# Altium schematic sheet main.SchDoc: Combined Coil Driver
size A3; Author: dvarx; Engineer: dvarx; Organization: MSRL
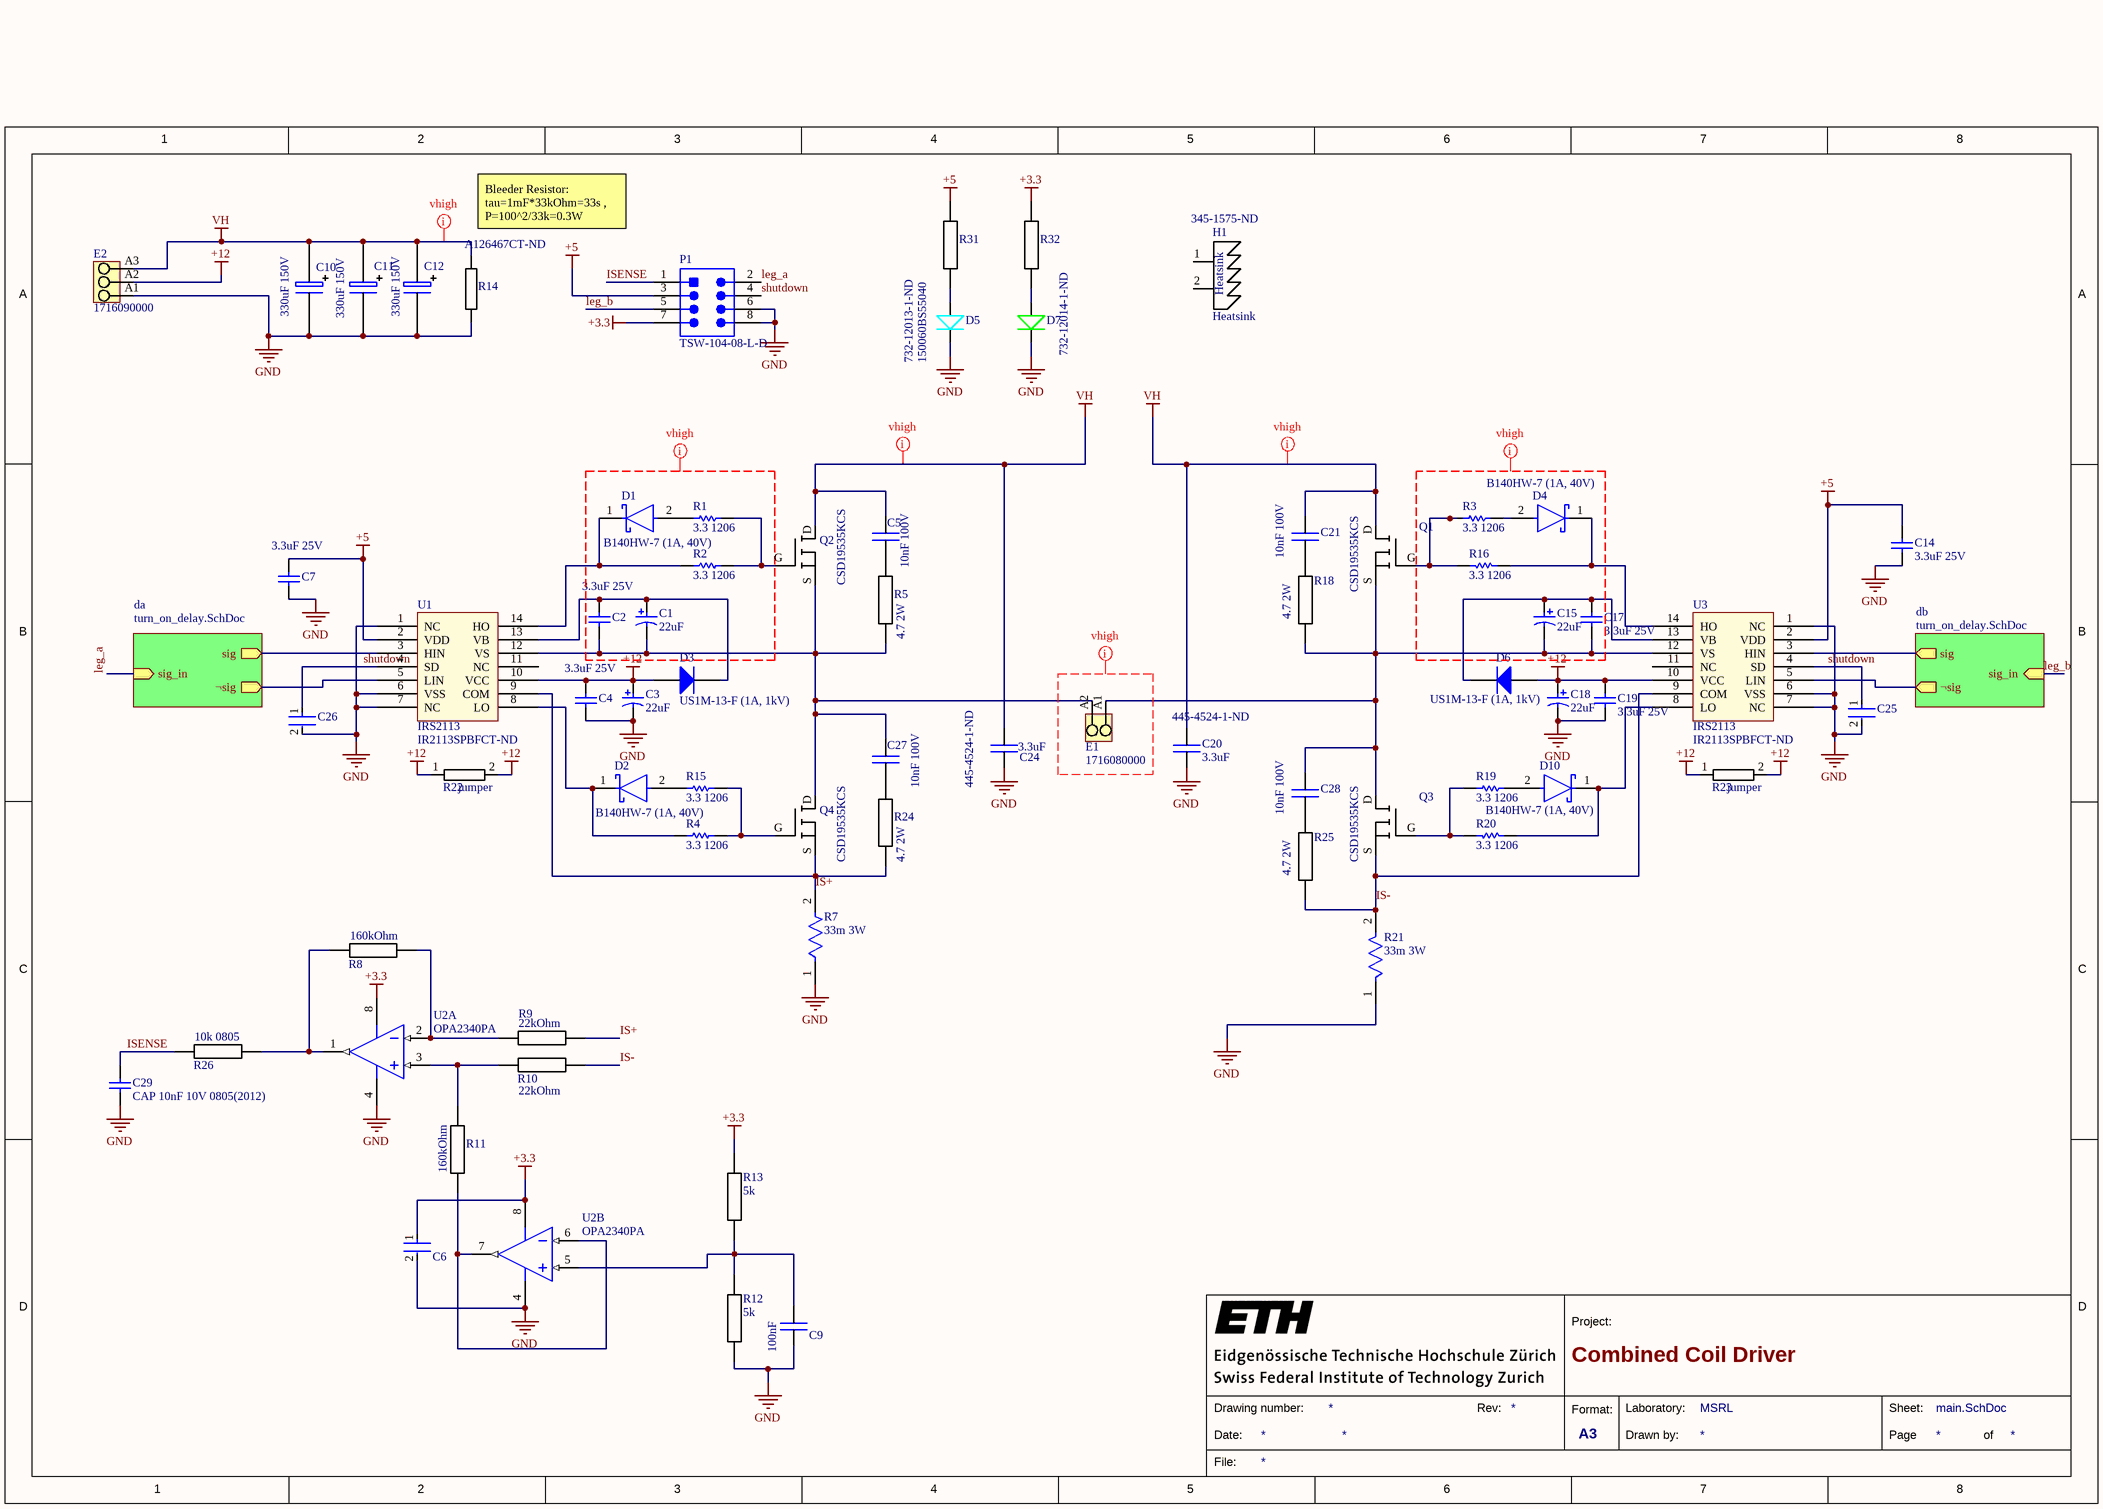
[diagram p0: main.SchDoc]

## Parts
C1  22uF  [KEMT-D-7343-31-2_L]
C2  3.3uF 25V  [CAPC1210(3225)170_M]
C3  22uF  [KEMT-D-7343-31-2_L]
C4  3.3uF 25V  [CAPC1210(3225)170_M]
C5  10nF 100V  [1206]
C6  C0603X104K5RACTU  [FP-C0603-CJ-MFG]  (value not drawn)
C7  3.3uF 25V  [CAPC1210(3225)170_M]
C9  100nF  [0805]
C10  330uF 150V  [cap_electrolyte]
C11  330uF 150V  [cap_electrolyte]
C12  330uF 150V  [cap_electrolyte]
C14  3.3uF 25V  [CAPC1210(3225)170_M]
C15  22uF  [KEMT-D-7343-31-2_L]
C17  3.3uF 25V  [CAPC1210(3225)170_M]
C18  22uF  [KEMT-D-7343-31-2_L]
C19  3.3uF 25V  [CAPC1210(3225)170_M]
C20  3.3uF  Supplier Part Number 1: 445-4524-1-ND  [SMD_5750]
C21  10nF 100V  [1206]
C24  3.3uF  Supplier Part Number 1: 445-4524-1-ND  [SMD_5750]
C25  CC0603KRX7R9BB103  [FP-CC0603-DA-MFG]  (value not drawn)
C26  CC0603KRX7R9BB103  [FP-CC0603-DA-MFG]  (value not drawn)
C27  10nF 100V  [1206]
C28  10nF 100V  [1206]
C29  CAP 10nF 10V 0805(2012)  [CAPC0805(2012)100_N]
D1  B140HW-7 (1A, 40V)  [FP-SOD123-MFG]
D2  B140HW-7 (1A, 40V)  [FP-SOD123-MFG]
D3  US1M-13-F (1A, 1kV)  [DIOD-SMA-2_A_V]
D4  B140HW-7 (1A, 40V)  [FP-SOD123-MFG]
D5  150060BS55040  Supplier Part Number 1: 732-12013-1-ND  [LED_BLUE_0603]
D6  US1M-13-F (1A, 1kV)  [DIOD-SMA-2_A_V]
D7  732-12014-1-ND  [LED_GREEN_0603]
D10  B140HW-7 (1A, 40V)  [FP-SOD123-MFG]
E1  1716080000  [LM_5_08_90_02]
E2  1716090000  [LM_5_08_90_03]
H1  Heatsink  Supplier Part Number 1: 345-1575-ND  [omni-uni-30-75-d]
P1  TSW-104-08-L-D  [SMTC-TSW-104-08-L-D_V]
Q1  CSD19535KCS  [TO-220]
Q2  CSD19535KCS  [TO-220]
Q3  CSD19535KCS  [TO-220]
Q4  CSD19535KCS  [TO-220]
R1  3.3 1206  [RESC3216X70X50LL05T20]
R2  3.3 1206  [RESC3216X70X50LL05T20]
R3  3.3 1206  [RESC3216X70X50LL05T20]
R4  3.3 1206  [RESC3216X70X50LL05T20]
R5  4.7 2W  [2512]
R7  33m 3W  [FP-KRL6432E-M-R033-F-T1-MFG]
R8  160kOhm  [0805]
R9  22kOhm  [0805]
R10  22kOhm  [0805]
R11  160kOhm  [0805]
R12  5k  [0805]
R13  5k  [0805]
R14  Supplier Part Number 1: A126467CT-ND  [res_bleeder]  (hidden comment: CRGH2512J33K)
R15  3.3 1206  [RESC3216X70X50LL05T20]
R16  3.3 1206  [RESC3216X70X50LL05T20]
R18  4.7 2W  [2512]
R19  3.3 1206  [RESC3216X70X50LL05T20]
R20  3.3 1206  [RESC3216X70X50LL05T20]
R21  33m 3W  [FP-KRL6432E-M-R033-F-T1-MFG]
R22  jumper  [tht_resistor_10mm]
R23  jumper  [tht_resistor_10mm]
R24  4.7 2W  [2512]
R25  4.7 2W  [2512]
R26  10k 0805  [0805]
R31  res_smd  [0805]  (value not drawn)
R32  res_smd  [0805]  (value not drawn)
U1  IRS2113  Supplier Part Number 1: IR2113SPBFCT-ND  [DIP14]
U2  OPA2340PA  [P0008A]  (parts A,B of 2)
U3  IRS2113  Supplier Part Number 1: IR2113SPBFCT-ND  [DIP14]

## Sub-sheets
da = turn_on_delay.SchDoc: sig_in (in), sig (out), ¬sig (out)
db = turn_on_delay.SchDoc: sig_in (in), sig (out), ¬sig (out)

## Nets
+3.3: C6.1 P1.7 R13.2 R32.1 U2.8(V+)
+5: C7.2 C14.2 P1.3 R31.1 U1.2(VDD) U3.2(VDD)
+12: C3.1 C4.2 C18.1 C19.2 D3.1(A) D6.1(A) E2.A2 R22.1 R22.2 R23.1 R23.2 U1.10(VCC) U3.10(VCC)
GND: C3.2 C4.1 C6.2 C7.1 C9.2 C10.2 C11.2 C12.2 C14.1 C18.2 C19.1 C20.2 C24.2 C25.2 C26.2 C29.1 D5.K D7.K E2.A1 P1.6 P1.8 R7.1 R12.1 R14.1 R21.1 U1.1(NC) U1.6(VSS) U1.7(NC) U2.4(V-) U3.1(NC) U3.6(VSS) U3.7(NC)
VH: C5.1 C10.1 C11.1 C12.1 C20.1 C21.1 C24.1 E2.A3 Q1.D Q2.D R14.2
IS+: Q4.S R7.2 R9.2 R24.2 U1.9(COM)
IS-: Q3.S R10.2 R21.2 R25.2 U3.9(COM)
ISENSE: C29.2 P1.1 R26.1
leg_a: P1.2 ; sheet da/sig_in
leg_b: P1.5 ; sheet db/sig_in
shutdown: C25.1 C26.1 P1.4 U1.4(SD) U3.4(SD)
NetC1_1: C1.1 C2.2 D3.2(K) U1.13(VB)
NetC1_2: C1.2 C2.1 C27.1 E1.A2 Q2.S Q4.D R5.2 U1.12(VS)
NetC5_2: C5.2 R5.1
NetC9_1: C9.1 R12.2 R13.1 U2.5(IN_B+)
NetC15_1: C15.1 C17.2 D6.2(K) U3.13(VB)
NetC15_2: C15.2 C17.1 C28.1 E1.A1 Q1.S Q3.D R18.2 U3.12(VS)
NetC21_2: C21.2 R18.1
NetC27_2: C27.2 R24.1
NetC28_2: C28.2 R25.1
NetD1_1: D1.1(C) R2.1 U1.14(HO)
NetD1_2: D1.2(A) R1.1
NetD2_1: D2.1(C) R4.1 U1.8(LO)
NetD2_2: D2.2(A) R15.1
NetD4_1: D4.1(C) R16.1 U3.14(HO)
NetD4_2: D4.2(A) R3.2
NetD5_A: D5.A R31.2
NetD7_A: D7.A R32.2
NetD10_1: D10.1(C) R20.1 U3.8(LO)
NetD10_2: D10.2(A) R19.2
NetQ1_G: Q1.G R3.1 R16.2
NetQ2_G: Q2.G R1.2 R2.2
NetQ3_G: Q3.G R19.1 R20.2
NetQ4_G: Q4.G R4.2 R15.2
NetR8_1: R8.1 R26.2 U2.1(OUT_A)
NetR8_2: R8.2 R9.1 U2.2(IN_A-)
NetR10_1: R10.1 R11.2 U2.3(IN_A+)
NetR11_1: R11.1 U2.6(IN_B-) U2.7(OUT_B)
NetU1_3: U1.3(HIN) ; sheet da/sig
NetU1_5: U1.5(LIN) ; sheet da/¬sig
NetU3_3: U3.3(HIN) ; sheet db/sig
NetU3_5: U3.5(LIN) ; sheet db/¬sig

Not connected (* = marked no-connect by the designer): H1 1(0) 2(1); U1 11(NC); U3 11(NC)

## Layout directives
net class vhigh: (no net found under the mark), VH

## Notes on the sheet
- (near R14) Bleeder Resistor: tau=1mF*33kOhm=33s , P=100^2/33k=0.3W
- 1
- 2
- 3
- 4
- 5
- 6
- 7
- 8
- A
- B
- C
- D
- Project:
- Date:
- Drawing number:
- Rev:
- Format:
- A3
- Drawn by:
- Laboratory:
- Page
- Sheet:
- of
- File:

## Library data of the parts
C1 C3 C15 C18 = CMP-2000-07210-1: Capacitor, Tantalum, 22 uF, +/- 10%, 35 V, -55 to 125 degC, 2-Pin Molded, RoHS, Tape and Reel; Manufacturer: Kemet; Seal: NotRequired; Voltage: 35VDC; Product Diameter (mm): NotRequiredmm; DCL: 7.7uA; ESR: 0.3ohm; Product Depth (mm): 4.3mm; Polarity: Polar; Capacitance: 22000000pF; DF: 6%; Product Height (mm): 2.8mm; Product Length (mm): 7.3mm; Rad Hardened: No; Mounting Technology: SurfaceMount; Packaging: TapeandReel; Case Code: D; Datasheet URL: https://datasheet.ciiva.com/28561/1780647-28561674.pdf; Case Style: Molded; Datasheet Version: 12/2013; Length W/Weld: NotRequiredmm; Insulation: NotRequired; Construction: SMTChip; Operating Temp Range: -55Cto125C; Lead Spacing (nom): NotRequiredmm; Package Description: 2-Pin Surface Mount Device, Body 7.3 x 4.3 mm, Height 3.1 mm; Package Reference: Molded-2; Wire Form: NotRequired; Length W/Weld (max): NotRequiredmm; Manufacturer URL: http://www.kemet.com/; Mounting Style: SurfaceMount; Tolerance (+ or -): 10%; Seated Plane Height: NotRequiredmm; Failure Rate: NotRequired; Package / Case: 7343-31
C2 C4 C7 C14 C17 C19 = CMP-1038-02118-1: CAP 3.3uF 25V ±10% 1210 (3225 Metric) Thickness 1.7mm SMD; Tolerance: Â±10%; Case-EIA: 1210; Case-Metric: 3225; Max Thickness: 1.7 mm; Technology: SMT; Value: 3.3uF; Rated Voltage: 25 V
C5 C9 C20 C21 C24 C27 C28 = cap_smd
  C5 C21 C27 C28: Supplier 1: Digi-Key; Supplier Part Number 1: 445-2334-1-ND; Supplier 2: Digi-Key; Supplier Part Number 2: 445-15417-1-ND; Supplier 3: Digi-Key; Supplier Part Number 3: 478-1512-1-ND
  C20 C24: Supplier 1: Digi-Key
C6 = CMP-2006-03300-2: CAP CER 0.1UF 50V X7R 0603; Manufacturer: Kemet; Capacitance: 100nF; Material: Ceramic; Tolerance: 10%; Value: 100nF; Temperature Coefficient: 15%; Temperature Range High: +125°C; Temperature Range Low: -55°C; Manufacturer Part Number: C0603X104K5RACTU; Voltage: 50V; ComponentLink2Description: Datasheet; RoHS: TRUE; ComponentLink2URL: https://content.kemet.com/datasheets/KEM_C1013_X7R_FT-CAP_SMD.pdf; Device Class L3: Ceramic Capacitors; Device Class L2: Capacitors; Package: C0603-CJ; Height: 0.95mm; Device Class L1: Passive Components; Temperature Characteristic: X7R; Lead Free: Yes; Digikey Description: CAP CER 0.1UF 50V X7R 0603; Automotive: No; Mouser Description: Capacitor; Ceramic; Cap 0.1uF; Tol+10%; SMT; Flexible Termination; Vol-Rtg 50V; TR; Temperature: -55°C to +125°C; Octopart: https://octopart.com/c0603x104k5ractu-kemet-9145062; Category: Cap; Voltage Rating: 50V; Ipc Land Pattern Name: CAPC16080X80
C10-C12 = cap_electrolyte: partno: UCS2C151MHD1TN; ComponentLink1Description: Supplier Link; ComponentLink1URL: https://www.digikey.ch/product-detail/en/nichicon/UCS2C151MHD1TN/493-7378-1-ND/3768656
C25 C26 = CMP-2100-03600-2: CAP CER 10000PF 50V X7R 0603; Manufacturer: YAGEO; Tolerance: 0.1; Material: Ceramic; Temperature Coefficient: 15%; Value: 10 nF; Mouser Description: Multilayer Ceramic Capacitor, CC Series, 0.01 - F, - 10%, X7R, 50 V, 0603 [1608 Metric]; Digikey Description: CAP CER 10000PF 50V X7R 0603; Height: 0.9mm; Category: Cap; Temperature Characteristic: X7R; Footprint Url: http://www.yageo.com/exep/pages/download/literatures/UPY-C_GEN_24.pdf; Lead Free: Yes; Voltage Rating: 50 V; Manufacturer Part Number: CC0603KRX7R9BB103; Temperature: -55°C to +125°C; Device Class L3: Ceramic Capacitors; ComponentLink2Description: Datasheet; Voltage: 50 V; Package: CC0603-DA; Octopart: https://octopart.com/cc0603krx7r9bb103-yageo-192938; Automotive: No; Temperature Range High: +125°C; Temperature Range Low: -55°C; RoHS: TRUE; Device Class L1: Passive Components; ComponentLink2URL: http://www.yageo.com/documents/recent/UPY-GPHC_X7R_6.3V-to-50V_18.pdf; Device Class L2: Capacitors; Capacitance: 10 nF
C29 = CMP-1036-03807-1: CAP 10nF 10V ±5% 0805 (2012 Metric) Thickness 1mm SMD; Case-Metric: 2012; Case-EIA: 0805; Tolerance: Â±5%; Rated Voltage: 10 V; Technology: SMT; Value: 10nF; Max Thickness: 1 mm
D1 = CMP-12790-000013-1: DIODE SCHOTTKY 40V 1A SOD123 Alternative: 1655-2275-1-ND - Cut Tape (CT)Alternative: MBRX120LF-TPMSCT-ND (20V)1655-1439-1-ND (60V); Manufacturer: Diodes Inc.; Peak Reverse Current: 40uA; Value: 120pF; Standoff Height: 0mm; Max Junction Temp: +125°C; Max Surge Forward Current: 16A; RoHS: TRUE; Ipc Land Pattern Name: SOD365155X110-2; Reverse Voltage: 40V; Temperature Range Low: -65°C; Capacitance: 120pF; Temperature Range High: +125°C; Mouser Description: Schottky Diodes & Rectifiers SCHOTTKY RECTIFIER SOD-123 1.0A 40V; ComponentLink2URL: https://www.diodes.com/assets/Datasheets/ds30670.pdf; Automotive: No; Package: SOD123; Octopart: https://octopart.com/b140hw-7-diodes+inc.-325751; Footprint Url: https://www.diodes.com/assets/Package-Files/SOD123.pdf; Max Repetitive Reverse Voltage: 40V; Category: Diode; Device Class L3: Schottky Diodes; Manufacturer Part Number: B140HW-7; Digikey Description: DIODE SCHOTTKY 40V 1A SOD123; Lead Free: Yes; Device Class L1: Discrete Semiconductors; ComponentLink2Description: Datasheet; Forward Current: 1A; Device Class L2: Diodes; Temperature: -65°C to +125°C; Height: 1.45mm
D2 D4 D10 = CMP-12790-000013-1: DIODE SCHOTTKY 40V 1A SOD123 Alternative: 1655-2275-1-ND - Cut Tape (CT); Manufacturer: Diodes Inc.; Peak Reverse Current: 40uA; Value: 120pF; Standoff Height: 0mm; Max Junction Temp: +125°C; Max Surge Forward Current: 16A; RoHS: TRUE; Ipc Land Pattern Name: SOD365155X110-2; Reverse Voltage: 40V; Temperature Range Low: -65°C; Capacitance: 120pF; Temperature Range High: +125°C; Mouser Description: Schottky Diodes & Rectifiers SCHOTTKY RECTIFIER SOD-123 1.0A 40V; ComponentLink2URL: https://www.diodes.com/assets/Datasheets/ds30670.pdf; Automotive: No; Package: SOD123; Octopart: https://octopart.com/b140hw-7-diodes+inc.-325751; Footprint Url: https://www.diodes.com/assets/Package-Files/SOD123.pdf; Max Repetitive Reverse Voltage: 40V; Category: Diode; Device Class L3: Schottky Diodes; Manufacturer Part Number: B140HW-7; Digikey Description: DIODE SCHOTTKY 40V 1A SOD123; Lead Free: Yes; Device Class L1: Discrete Semiconductors; ComponentLink2Description: Datasheet; Forward Current: 1A; Device Class L2: Diodes; Temperature: -65°C to +125°C; Height: 1.45mm
  D4: Parameter 1: *
D3 D6 = CMP-2000-07364-1: Ultra-Fast Rectifier, 1 A, 1.7 V, -65 to 150 degC, 2-Pin SMA, RoHS, Tape and Reel; Manufacturer: Diodes Inc; Forward Voltage: 1.7V; Reverse Recovery Time-Max: 75ns; Reverse Current-Max: 5µA; Reverse Voltage-Max [Vrrm]: 1000V; Package Description: 2-Pin Surface Mount Device, Body 4.3 x 2.605 mm; Datasheet URL: http://www.diodes.com/_files/datasheets/ds16008.pdf; Average Rectified Current-Max: 1A; Datasheet Version: Rev. 11-2, 12/2014; Package Reference: SMA-2; Mounting Technology: SurfaceMount; Manufacturer URL: http://www.diodes.com/
D5 = led_blue_0603: Supplier 1: Digi-Key
D7 = led_green_0603: Supplier 1: Digi-Key; Supplier Part Number 1: 732-12014-1-ND
E1 = CMP-1559-01766-1: OMNIMATE Signal - series LM; Manufacturer: Weidmueller; Solder_pin_length_mm: 3,5 mm; Solid_max_H05_07_V_U: 2,5 mm²; Contact_material: Cu-Leg; No_of_poles: 2; Mounting_onto_the_PCB: Solder connection; Contact_surface: tinned; Wire_cross_section_AWG_max_UL_1059: AWG 14; Rated_voltage_for_surge_voltage_class_pollution_degree_II_2: 630 V; Side_termination_characteristic: closed side; UL_94_flammability_rating: V-0; Wire_cross_section_AWG_min_UL_1059: AWG 24; Pitch_mm: 5,08 mm; Pitch_inch: 0,2 inch; Rated_voltage_use_group_B_UL_1059: 300 V; Solid_min_H05_07_V_U: 0,2 mm²; Short_text_for_material: LM 5.08/02/90 3.5SN OR BX; Insulating_material: Wemid (PA); Rated_current_use_group_B_UL_1059: 15 A; PartNumber: 1716080000; Colour: Orange; ComponentLink1URL: http://www.weidmueller.com/; ComponentLink1Description: Manufacturer URL; Revision: V1; Qty: 500 PCS; ComponentLink2Description: URL Link1; ComponentLink2URL: http://catalog.weidmueller.com/catalog/Start.do?localeId=en&ObjectID=1716080000; Packaging: Box; PackageReference: LM_5_08_90_02
E2 = CMP-1559-01768-1: OMNIMATE Signal - series LM; Manufacturer: Weidmueller; Contact_surface: tinned; Pitch_mm: 5,08 mm; Solder_pin_length_mm: 3,5 mm; Contact_material: Cu-Leg; Wire_cross_section_AWG_min_UL_1059: AWG 24; Solid_min_H05_07_V_U: 0,2 mm²; Insulating_material: Wemid (PA); Solid_max_H05_07_V_U: 2,5 mm²; Pitch_inch: 0,2 inch; Wire_cross_section_AWG_max_UL_1059: AWG 14; UL_94_flammability_rating: V-0; No_of_poles: 3; Rated_voltage_use_group_B_UL_1059: 300 V; Mounting_onto_the_PCB: Solder connection; Side_termination_characteristic: closed side; Short_text_for_material: LM 5.08/03/90 3.5SN OR BX; Rated_current_use_group_B_UL_1059: 15 A; Rated_voltage_for_surge_voltage_class_pollution_degree_II_2: 630 V; Revision: V1; ComponentLink2URL: http://catalog.weidmueller.com/catalog/Start.do?localeId=en&ObjectID=1716090000; Colour: Orange; PackageReference: LM_5_08_90_03; ComponentLink1Description: Manufacturer URL; ComponentLink2Description: URL Link1; ComponentLink1URL: http://www.weidmueller.com/; Qty: 500 PCS; PartNumber: 1716090000; Packaging: Box
P1 = CMP-1681-00006-4: Male Header, Pitch 2.54 mm, 2 x 4 Position, Height 8.38 mm, Tail Length 5.08 mm, -55 to 125 degC, RoHS, Bulk; Manufacturer: Samtec; Voltage Rating: 550 V; Current Rating: 7.6 A; Rows: 2; ComponentLink2URL: https://datasheet.ciiva.com/25616/0900766b81154476-25616879.pdf; Package Quantity: 1; PackageDescription: Male Header, Pitch 2.54 mm, 2 x 4 Position, Height 8.38 mm, Tail Length 5.08 mm; ComponentLink1Description: Manufacturer URL; Lead Pitch: 0.1 inch; REACH SVHC: No SVHC; Mounting Technology: Through Hole; PackageReference: TSW-104-08-L-D; Contact Plating: Gold; DatasheetVersion: 04/2012; Colour: Black; Contact Finish: Gold; ComponentLink3URL: http://suddendocs.samtec.com/prints/tsw-xxx-xx-x-x-xx-xxx-footprint.pdf; ComponentLink3Description: Package Specification; Mount: Through Hole; RoHSCompliant: true; Packaging: Bulk; ComponentLink2Description: Datasheet; Contact Material: Bronze; Pins: 8; ComponentLink1URL: http://www.samtec.com/
R1-R4 R15 R16 R19 R20 = CMP-2003-00687-1: Part Number: ERJ-8RQF3R3V; Manufacturer: Panasonic
R5 R8-R13 R18 R24-R26 = res_smd
  R5 R18 R24 R25: Supplier 1: Digi-Key; Supplier Part Number 1: CRM2512-JW-4R7ELFCT-ND; Supplier 2: Digi-Key; Supplier Part Number 2: CRM2512-JW-2R2ELFCT-ND; Supplier 3: Digi-Key; Supplier Part Number 3: CRM2512-JW-1R0ELFCT-ND; Supplier 4: Digi-Key; Supplier Part Number 4: CRM2512-JW-100ELFCT-ND
R7 R21 = CMP-28537-000006-1: RES 0.033 OHM 3W 2512 WIDE; Manufacturer Part Number: KRL6432E-M-R033-F-T1; Manufacturer: Susumu; Automotive Grade: Grade 0; Temperature Coefficient: 50ppm/°C; Value: 33mΩ; Tolerance: 1%; Temperature Range Low: -55°C; Octopart: https://octopart.com/krl6432e-m-r033-f-t1-susumu-24927468; Ipc Land Pattern Name: RESC310630X50; Power Rating: 3W; Device Class L3: Chip SMD Resistors; Mouser Description: Current Sense Resistors - SMD 3W 0.033ohm 1% 50ppm; Category: Res; Package: KRL6432E-M-R033-F-T1; Temperature Range High: +155°C; Footprint Url: https://forum.upverter.com/uploads/short-url/r9IKEUF81AhWn8YVzwFFOeIy71.pdf; Device Class L1: Passive Components; ComponentLink2Description: Datasheet; RoHS: TRUE; Lead Free: Yes; ComponentLink2URL: http://www.susumu.co.jp/common/pdf/n_catalog_partition19_en.pdf; Automotive: Yes; Temperature: -55°C to +155°C; Digikey Description: RES 0.033 OHM 3W 2512 WIDE; Device Class L2: Resistors; Height: 0.7mm; Series: KRL; Composition: Metal Foil; Resistance: 33mΩ
R14 = res_bleeder: 33kOhm 2W; partno: CRGH2512J33K; Supplier 1: Digi-Key
R22 R23 = res_th
U1 U3 = IR2113: Supplier 1: Digi-Key
U2 = CMP-0272-01604-3: Single-Supply, Rail-to-Rail Operational Amplifier MicroAmplifier(TM) Series, 2.5 to 5.5 V, -40 to 85 degC, 8-pin DIP (P8), Green (RoHS & no Sb/Br); Manufacturer: Texas Instruments; Iq per channel(Max)(mA): 0.95; CMRR(Min)(dB): 80; Number of Channels: 2; Vio (25C)(Max)(mV): 0.5; IIB(Max)(pA): 10; Total Supply Voltage(Min)(+5V is 5, +/-5V is 10): 2.5; Slew Rate(Typ)(V/us): 6; Total Supply Voltage(Max)(+5V is 5, +/-5V is 10): 5.5; Sub Family: Low Input Bias Current Amp (<=10pA), Low Offset Voltage Amplifier (<=500uV), Low Supply Voltage Amplifier (<=2.7V), Precision Amplifier; Vn at 1kHz(Typ)(nV/rtHz): 25; ComponentLink3Description: Package Specification; Eco-Plan: Green (RoHS & no Sb/Br); PackageDescription: 8-Pin Plastic In-Line, Body 9.59 x 6.35 mm, Pitch 2.54 mm; ComponentLink2Description: Datasheet; Code_JEDEC: MS-001; ComponentLink1URL: http://www.ti.com/; ComponentLink1Description: Manufacturer URL; Mounting Technology: Through Hole; ComponentLink3URL: http://www.ti.com/litv/pdf/mpdi001b; ComponentLink2URL: http://www.ti.com/general/docs/lit/getliterature.tsp?genericPartNumber=OPA2340&fileType=pdf; Offset Drift(Typ)(uV/C): 2.5; PartNumber: OPA2340PA; PackageReference: P0008A; PackageVersion: 4040082/E, 04/2010; DatasheetVersion: SBOS073B
H1 = Heatsink: Supplier 1: Digi-Key
Q1-Q4 = CSD19535KCS: Supplier 1: Digi-Key; Supplier Part Number 1: 296-37288-5-ND